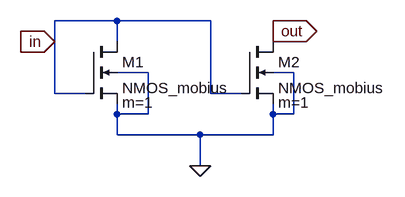
[diagram p0: schematic nMOS_currentMirror.asc]
nMOS_currentMirror.asc, the LTspice schematic file:
Version 4
SHEET 1 880 680
WIRE 112 64 16 64
WIRE 256 64 112 64
WIRE 352 80 352 64
WIRE 16 96 16 64
WIRE 112 96 112 64
WIRE 352 96 352 80
WIRE 160 144 112 144
WIRE 384 144 352 144
WIRE 16 176 16 96
WIRE 64 176 16 176
WIRE 256 176 256 64
WIRE 304 176 256 176
WIRE 112 208 112 192
WIRE 160 208 160 144
WIRE 160 208 112 208
WIRE 352 208 352 192
WIRE 384 208 384 144
WIRE 384 208 352 208
WIRE 112 240 112 208
WIRE 240 240 112 240
WIRE 352 240 352 208
WIRE 352 240 240 240
WIRE 240 288 240 240
FLAG 352 80 out
IOPIN 352 80 Out
FLAG 16 96 in
IOPIN 16 96 In
FLAG 240 288 0
SYMBOL nmos4 64 96 R0
WINDOW 123 56 94 Left 2
SYMATTR InstName M1
SYMATTR Value NMOS_mobius
SYMATTR Prefix X
SYMATTR Value2 m=1
SYMBOL nmos4 304 96 R0
WINDOW 123 56 94 Left 2
SYMATTR InstName M2
SYMATTR Value NMOS_mobius
SYMATTR Prefix X
SYMATTR Value2 m=1

The netlist it stands for:
* nMOS_currentMirror.asc
XM1 in in 0 0 NMOS_mobius m=1  ; pins D G S B
XM2 out in 0 0 NMOS_mobius m=1  ; pins D G S B
.backanno
.end